# EAGLE design ft232 base stripboard (EAGLE 7.3.0)
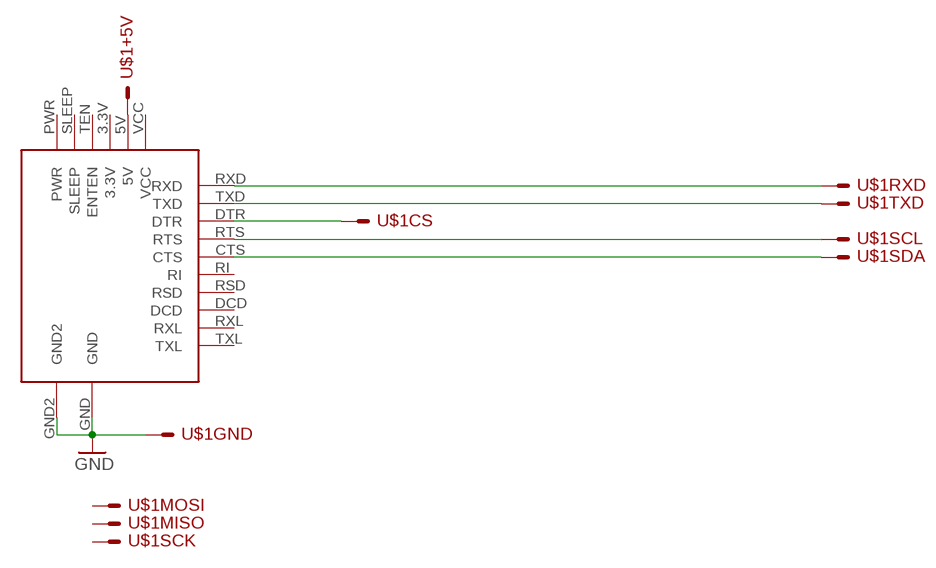
[diagram p0: schematic, sheet 1]

## Parts
U$1  SPI_BUS  [SPI_BUS]
U$3  FTDI232  [FT232-MODULE]

## Nets
GND: U$1.GND U$3.GND U$3.GND2
N$1: U$1.RXD U$3.RXD
N$2: U$1.+5V U$3.5V
N$3: U$1.TXD U$3.TXD
N$4: U$1.CS U$3.DTR
N$5: U$1.SDA U$3.CTS
N$6: U$1.SCL U$3.RTS
Unconnected: U$1.MISO U$1.MOSI U$1.SCK U$3.3.3V U$3.DCD U$3.PWR U$3.RI U$3.RSD U$3.RXL U$3.SLEEP U$3.TEN(ENTEN) U$3.TXL U$3.VCC

## Library data of the parts
U$1 = lieven:SPI_BUS
U$3 = lieven:FTDI232

## Board
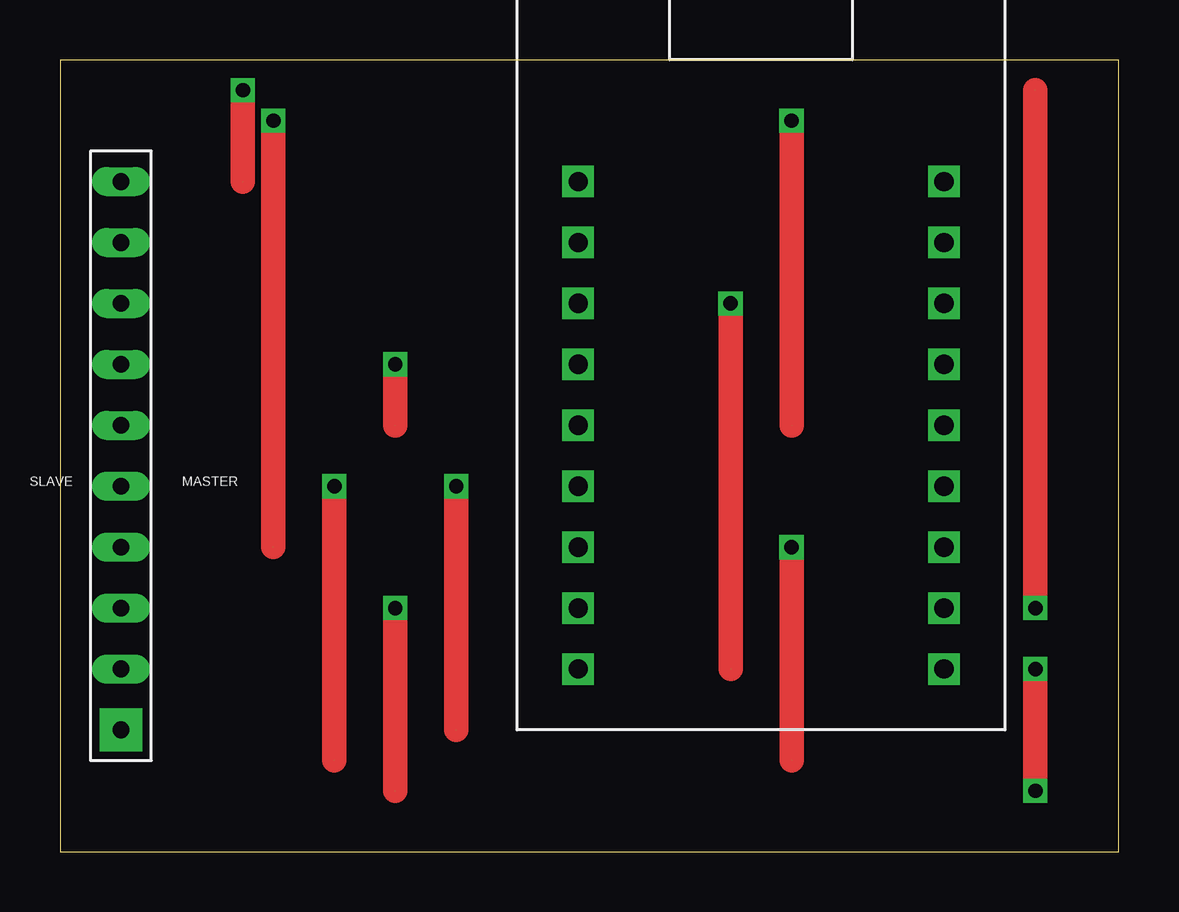
[diagram p1: board, top side]
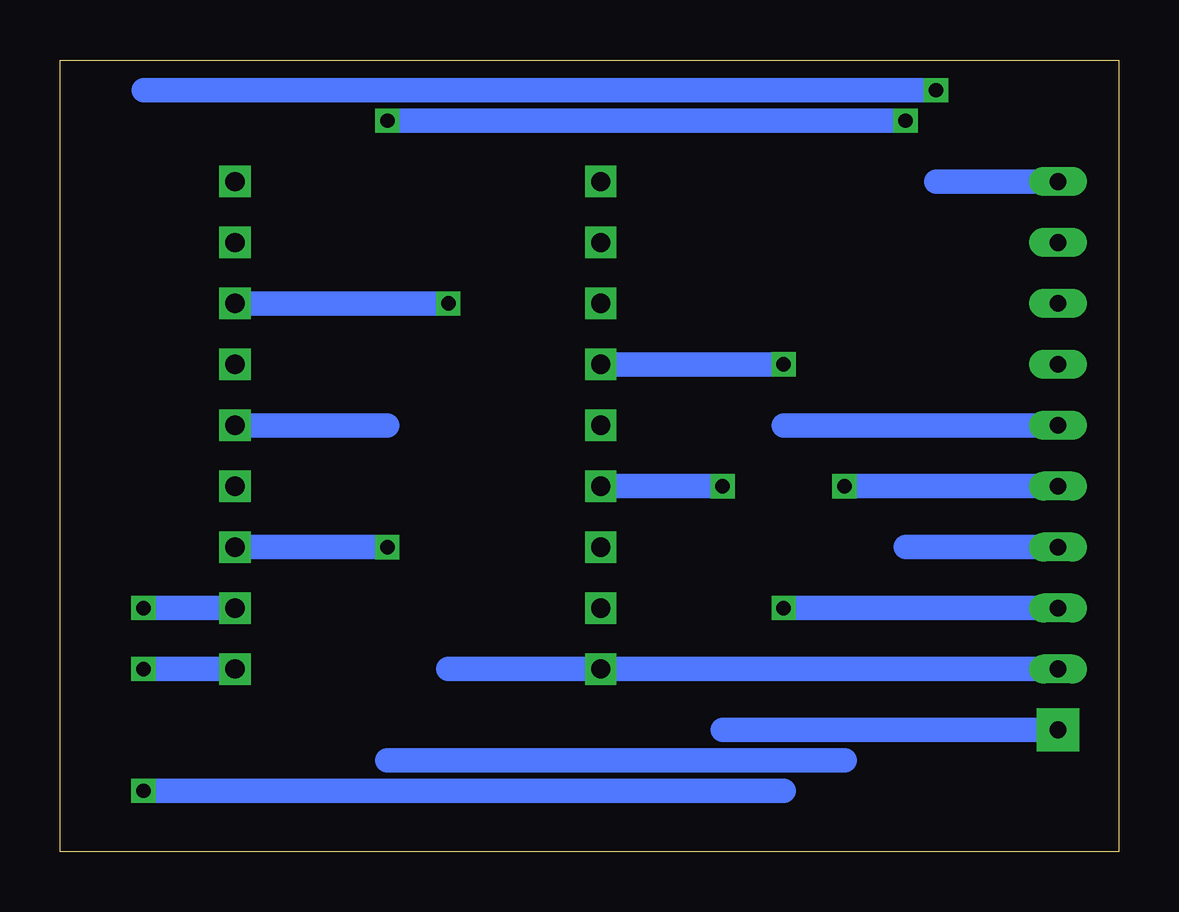
[diagram p2: board, bottom side, seen from below]

Size 44.12 x 33.01 mm. Coordinates in mm from the lower left corner, seen from the top.
Outline: 0,0 44.12,0 44.12,33.01 0,33.01 0,0
Copper layers (1*16): Top 0.035mm / dielectric 1.5mm / Bottom 0.035mm
Design rules "default": minimum track width 10mil, minimum drill 24mil, track to track 8mil, track to pad 8mil, pad to pad 8mil, via to via 8mil, smd to smd 8mil, copper to edge 40mil, drill to drill 8mil, minimum pad ring 10mil, minimum via ring 8mil, stop-mask expansion 4mil, vias tented up to drill 0mil, thermal gap 10mil

### Footprints (pad centres in the part's own frame; a part is rotated, then mirrored left to right if it is on the bottom)
SPI_BUS = drill 0.7 pad 1.778 square: +5V 0,0 | drill 0.7 long: CS 0,22.86; GND 0,2.54; MISO 0,15.24; MOSI 0,17.78; RXD 0,7.62; SCK 0,20.32; SCL 0,10.16; SDA 0,12.7; TXD 0,5.08
FT232-MODULE = drill 0.8 square: 3.3V 2.54,-5.08; 5V 5.08,-5.08; CTS 0,-5.08; DCD -7.62,10.16; DTR 10.16,10.16; GND 12.7,-5.08; GND2 -2.54,10.16; PWR -7.62,-5.08; RI 0,10.16; RSD -5.08,10.16; RTS 7.62,10.16; RXD 2.54,10.16; RXL 7.62,-5.08; SLEEP -2.54,-5.08; TEN -5.08,-5.08; TXD 12.7,10.16; TXL 10.16,-5.08; VCC 5.08,10.16

### Placement (x,y rotation side)
U$1  2.54,5.08 0 top
U$3  26.67,20.32 270 top

### Tracks (layer width: path | path; a pad name or v marks a point on that pad's centre or on a via)
GND  (via drill 0.6)  (1 unrouted)
  Top 1.016: v27.94,22.86 27.94,7.62
  Bottom 1.016: U$1.GND U$3.GND 27.94,7.62 | U$3.GND2 v27.94,22.86
N$1  (via drill 0.6)  (2 unrouted)
  Top 1.016: v30.48,30.48 30.48,17.78 | v8.89,30.48 8.89,12.7
  Bottom 1.016: U$1.RXD 8.89,12.7 | U$3.RXD 30.48,17.78 | v30.48,30.48 v8.89,30.48
N$2  (via drill 0.6)  (1 unrouted)
  Top 1.016: v16.51,15.24 16.51,5.08
  Bottom 1.016: U$1.+5V 16.51,5.08 | U$3.5V v16.51,15.24
N$3  (via drill 0.6)  (1 unrouted)
  Top 1.016: v13.97,10.16 13.97,2.54 | v40.64,7.62 v40.64,2.54
  Bottom 1.016: U$1.TXD v13.97,10.16 | v40.64,2.54 13.97,2.54 | U$3.TXD v40.64,7.62
N$4  (via drill 0.6)  (3 unrouted)
  Top 1.016: v7.62,31.75 7.62,27.94 | v40.64,10.16 40.64,31.75
  Bottom 1.016: U$1.CS 7.62,27.94 | v7.62,31.75 40.64,31.75 | v40.64,10.16 U$3.DTR
N$5  (via drill 0.6)  (1 unrouted)
  Top 1.016: v13.97,20.32 13.97,17.78
  Bottom 1.016: U$1.SDA 13.97,17.78 | v13.97,20.32 U$3.CTS
N$6  (via drill 0.6)  (2 unrouted)
  Top 1.016: v11.43,15.24 11.43,3.81 | v30.48,12.7 30.48,3.81
  Bottom 1.016: U$3.RTS v30.48,12.7 | 30.48,3.81 11.43,3.81 | U$1.SCL v11.43,15.24